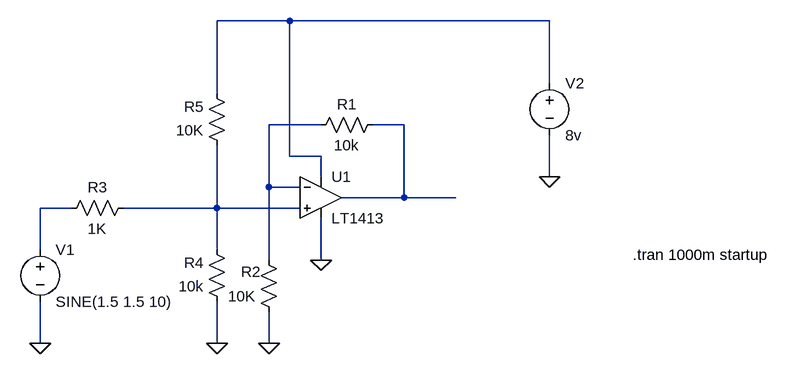
[diagram p0: schematic ShiftOutputVoltage.asc]
ShiftOutputVoltage.asc, the LTspice schematic file:
Version 4
SHEET 1 912 680
WIRE 160 16 48 16
WIRE 560 16 160 16
WIRE 560 112 560 16
WIRE 48 128 48 16
WIRE 208 176 128 176
WIRE 336 176 288 176
WIRE 160 224 160 16
WIRE 208 224 160 224
WIRE 208 256 208 224
WIRE 560 256 560 192
WIRE 128 272 128 176
WIRE 176 272 128 272
WIRE 336 288 336 176
WIRE 336 288 240 288
WIRE 416 288 336 288
WIRE -176 304 -224 304
WIRE 48 304 48 208
WIRE 48 304 -96 304
WIRE 176 304 48 304
WIRE -224 368 -224 304
WIRE 48 368 48 304
WIRE 128 384 128 272
WIRE 208 384 208 320
WIRE -224 512 -224 448
WIRE 48 512 48 448
WIRE 128 512 128 464
FLAG 128 512 0
FLAG -224 512 0
FLAG 560 256 0
FLAG 208 384 0
FLAG 48 512 0
SYMBOL Opamps/LT1413 208 224 R0
SYMATTR InstName U1
SYMBOL res 304 160 R90
WINDOW 0 0 56 VBottom 2
WINDOW 3 32 56 VTop 2
SYMATTR InstName R1
SYMATTR Value 10k
SYMBOL res 144 480 R180
WINDOW 0 28 78 Left 2
WINDOW 3 36 40 Left 2
SYMATTR InstName R2
SYMATTR Value 10K
SYMBOL res -80 288 R90
WINDOW 0 0 56 VBottom 2
WINDOW 3 32 56 VTop 2
SYMATTR InstName R3
SYMATTR Value 1K
SYMBOL res 64 464 R180
WINDOW 0 36 76 Left 2
WINDOW 3 36 40 Left 2
SYMATTR InstName R4
SYMATTR Value 10k
SYMBOL voltage -224 352 R0
SYMATTR InstName V1
SYMATTR Value SINE(1.5 1.5 10)
SYMBOL voltage 560 96 R0
SYMATTR InstName V2
SYMATTR Value 8v
SYMBOL res 64 224 R180
WINDOW 0 36 76 Left 2
WINDOW 3 36 40 Left 2
SYMATTR InstName R5
SYMATTR Value 10K
TEXT 688 376 Left 2 !.tran 1000m startup

The netlist it stands for:
* ShiftOutputVoltage.asc
XU1 N005 N002 N001 0 N003 LT1413  ; pins In+ In- V+ V- OUT
R1 N003 N002 10k
R2 0 N002 10K
R3 N005 N004 1K
R4 0 N005 10k
V1 N004 0 SINE(1.5 1.5 10)
V2 N001 0 8v
R5 N005 N001 10K
.tran 1000m startup
.lib LTC.lib
.backanno
.end